# EAGLE design fita_LED (EAGLE 9.6.2)
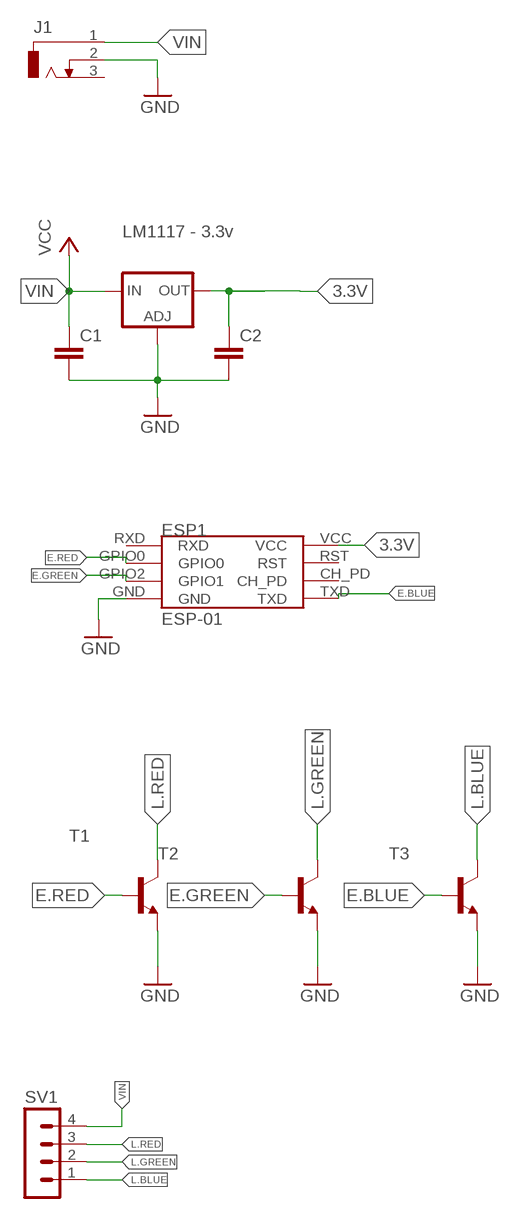
[diagram p0: schematic, sheet 1]

## Parts
C1  C-EUC0805  [C0805]
C2  C-EUC0805  [C0805]
ESP1  ESP-01  [ESP-01]
IC1  LM1117 - 3.3v  LD117AS18TR  [SOT223]
J1  DCJ0303  [DCJ0303]
SV1  MA04-1  [MA04-1]
T1  BC817-16-NPN-SOT23-BEC  [SOT23-BEC]
T2  BC817-16-NPN-SOT23-BEC  [SOT23-BEC]
T3  BC817-16-NPN-SOT23-BEC  [SOT23-BEC]

## Nets
3.3V: C2.1 ESP1.VCC IC1.4(OUT)
E.BLUE: ESP1.TXD T3.B
E.GREEN: ESP1.GPIO2(GPIO1) T2.B
E.RED: ESP1.GPIO0 T1.B
GND: C1.2 C2.2 ESP1.GND IC1.1(ADJ) J1.2 T1.E T2.E T3.E
L.BLUE: SV1.1 T3.C
L.GREEN: SV1.2 T2.C
L.RED: SV1.3 T1.C
VIN: C1.1 IC1.3(IN) J1.1 SV1.4 ; supply symbol labelled VCC
Unconnected: ESP1.CH_PD ESP1.RST ESP1.RXD J1.3

## Library data of the parts
C1 C2 = rcl:C-EU: CAPACITOR, European symbol; SPICEPREFIX: C
ESP1 = ESP-01:ESP-01: Check prices <https://pricing.snapeda.com/parts/ESP-01/AI-Thinker/view-part?ref=eda>; AVAILABILITY: No availability data; DESCRIPTION: 802.11 b/g/n, Integrated low power 32-bit MCU; MF: AI-Thinker; MP: ESP-01; PACKAGE: Package; PRICE: None
IC1 = v-reg:LD117A?*: Low drop fixed and adjustable positive voltage regulators 1 A Source: http://www.st.com/stonline/products/literature/ds/7194/ld1117axx.pdf
J1 = con-jack:DCJ0303: DC POWER JACK Source: DCJ0303.pdf; OC_FARNELL: unknown; OC_NEWARK: unknown
SV1 = con-lstb:MA04-1: PIN HEADER; OC_FARNELL: unknown; OC_NEWARK: unknown
T1-T3 = transistor:*-NPN-: NPN Transistror BF959 corrected 2008.03.06

## Board
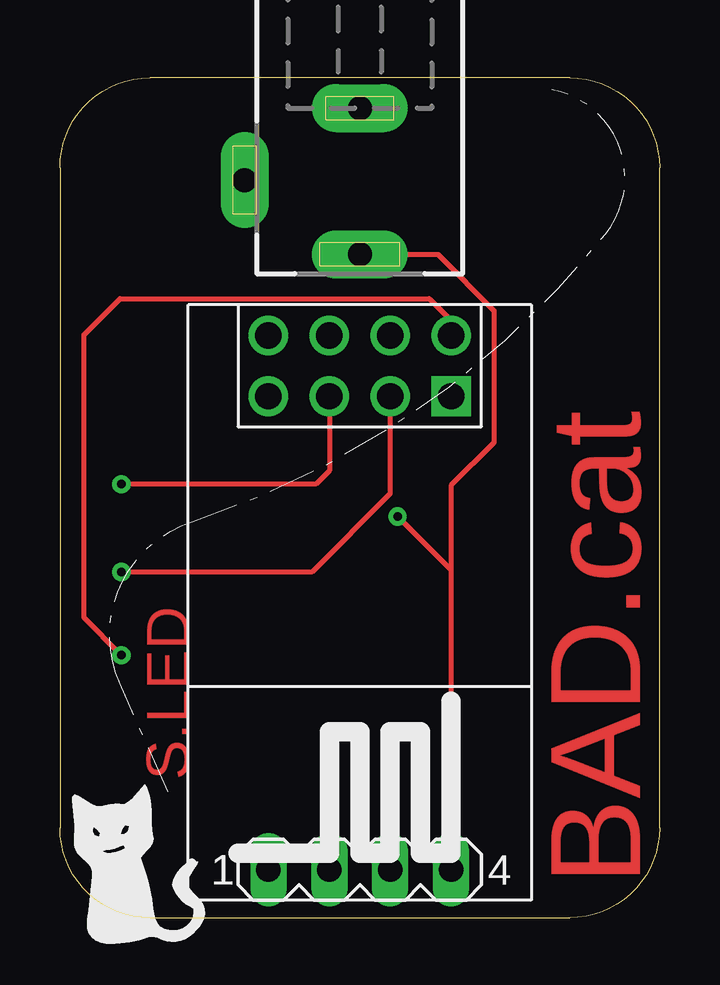
[diagram p1: board, top side]
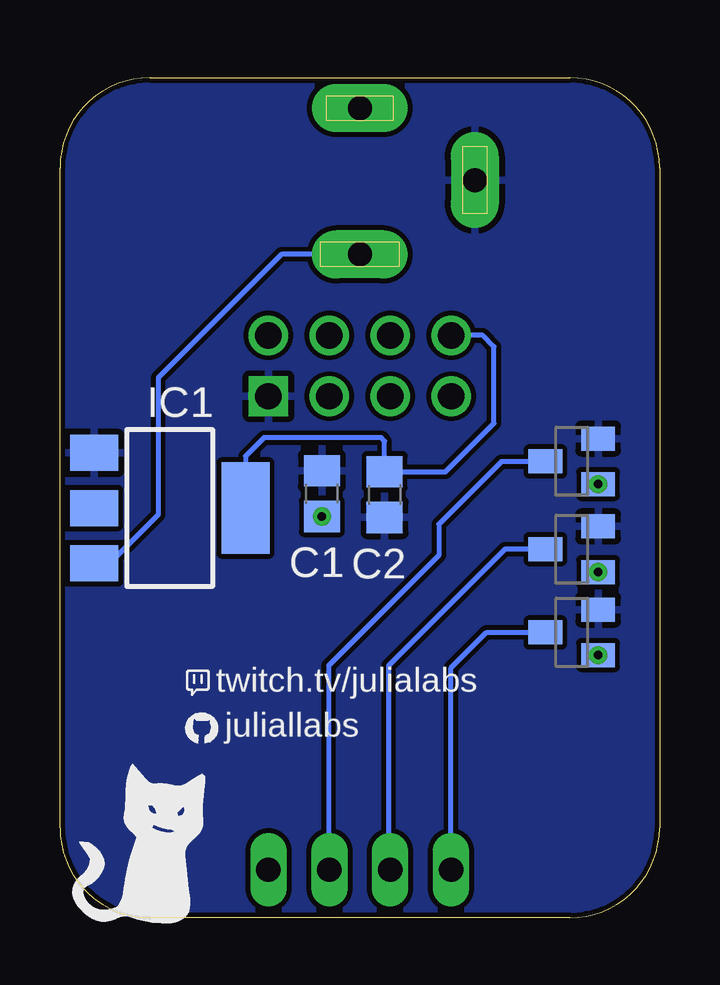
[diagram p2: board, bottom side, seen from below]

Size 25 x 35 mm. Coordinates in mm from the lower left corner, seen from the top.
Outline: 25,31.25 25,3.75 arc-90 21.25,0 3.75,0 arc-90 0,3.75 0,31.25 arc-90 3.75,35 21.25,35
Outline: 21.25,35 arc-90 25,31.25
Outline: 21.25,35 arc-90 25,31.25
Copper layers (1*16): Top 0.035mm / dielectric 1.5mm / Bottom 0.035mm
Design rules "default": minimum track width 8mil, minimum drill 0.35mm, track to track 8mil, track to pad 8mil, pad to pad 8mil, via to via 8mil, smd to smd 8mil, copper to edge 8mil, drill to drill 8mil, minimum pad ring 10mil, minimum via ring 8mil, stop-mask expansion 4mil, vias tented up to drill 0mil, thermal gap 10mil

### Footprints (pad centres in the part's own frame; a part is rotated, then mirrored left to right if it is on the bottom)
C0805 = smd 1.3 x 1.5: 1 -0.95,0; 2 0.95,0
ESP-01 = drill 1.1: CH_PD 1.27,1.27; GPIO0 3.81,-1.27; GPIO2 3.81,1.27; RST 1.27,-1.27; RXD 3.81,-3.81; TXD 1.27,3.81; VCC 1.27,-3.81 | drill 1.1 square: GND 3.81,3.81
SOT223 = smd 1.5 x 2: 1 -2.3,-3.15; 2 0,-3.15; 3 2.3,-3.15 | smd 3.8 x 2: 4 0,3.15
DCJ0303 = drill 1 pad 2 long: 1 0,3.1; 2 4.8,0; 3 0,-3
MA04-1 = drill 1.016 long: 1 -3.81,0; 2 -1.27,0; 3 1.27,0; 4 3.81,0
SOT23-BEC = smd 1 x 1.4: B -0.95,-1.1; C 0,1.1; E 0.95,-1.1

### Placement (x,y rotation side)
C1  14.08,17.67 90 bottom
C2  11.46,17.63 270 bottom
ESP1  12.5,25.54 270 top
IC1  20.42,17.07 270 bottom
J1  12.5,30.74 180 top
SV1  12.5,2 0 top
T1  3.66,19.02 90 bottom
T2  3.66,15.35 90 bottom
T3  3.66,11.89 90 bottom

### Tracks (layer width: path | path; a pad name or v marks a point on that pad's centre or on a via)
3.3V
  Bottom 0.203: IC1.4 17.27,19.23 16.5,20 11.6,20 11.46,19.86 C2.1 8.92,18.58 6.9,20.6 6.9,23.8 7.37,24.27 ESP1.VCC
E.BLUE  (via drill 0.35)
  Top 0.203: T3.B 1,12.5 1,24.3 2.5,25.8 15.4,25.8 16.31,24.89 ESP1.TXD
  other vias: 2.56,10.94
E.GREEN  (via drill 0.35)
  Top 0.203: ESP1.GPIO2 13.77,17.67 10.5,14.4 T2.B
  other vias: 2.56,14.4
E.RED  (via drill 0.35)
  Top 0.203: ESP1.GPIO0 11.23,18.63 10.67,18.07 T1.B
  other vias: 2.56,18.07
GND
  pour Bottom: 0,36 0,-0.3 25.3,-0.3 25.3,36
L.BLUE
  Bottom 0.203: SV1.1 8.69,10.41 7.21,11.89 T3.C
L.GREEN
  Bottom 0.203: T2.C 6.45,15.35 11.3,10.5 11.3,2.07 SV1.2
L.RED
  Bottom 0.203: T1.C 4.78,19 6.6,19 9.2,16.4 9.2,15.1 13.8,10.5 13.8,2.03 SV1.3
VIN  (via drill 0.35)
  Top 0.203: J1.1 15.76,27.64 18.1,25.3 18.1,19.8 16.31,18.01 16.31,14.5 | 16.31,14.5 SV1.4 | C1.1 16.3,14.5 16.31,14.5
  Bottom 0.203: J1.1 15.76,27.64 20.9,22.5 20.9,16.8 23.4,14.3 24.2,14.3 23.73,14.77 IC1.3
  Bottom 0.305: 23.4,14.6 IC1.3
  other vias: 14.08,16.72

### Text on the board
Top: S.LED | BAD.cat
bPlace: twitch.tv/julialabs | juliallabs
bStop: V | B | G | R | R